# EAGLE design moodlight (EAGLE 6.5.0)
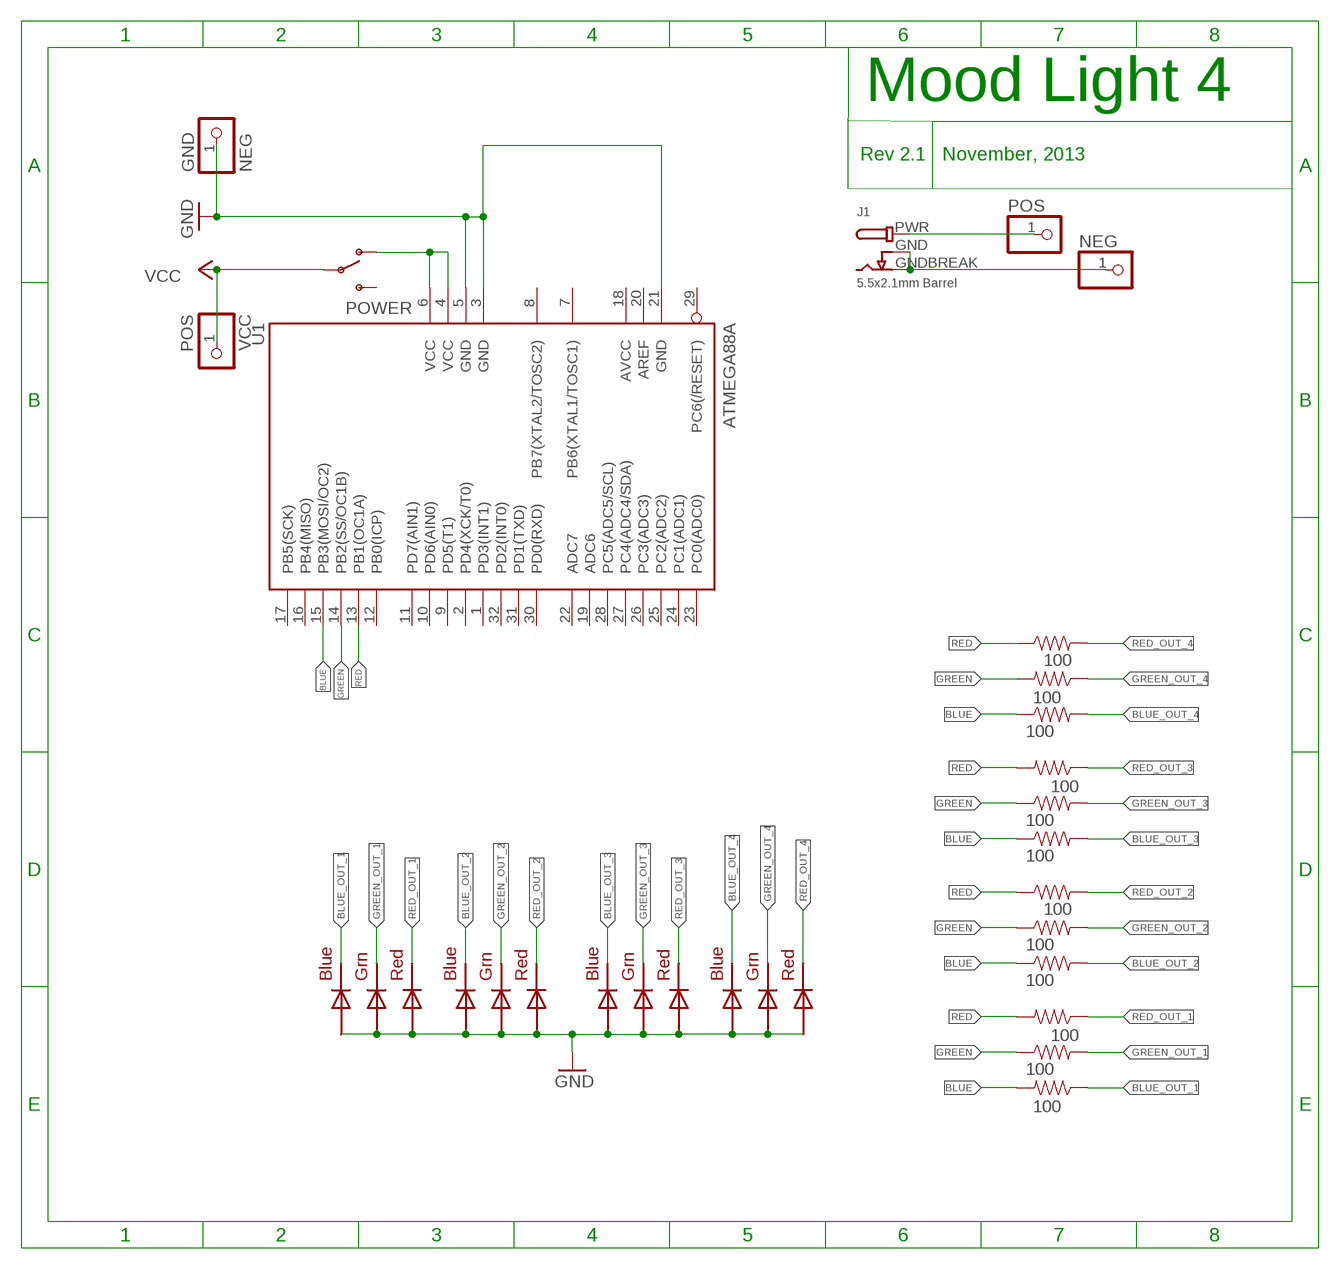
[diagram p0: schematic, sheet 1]

## Parts
GND  NEG  PINHD-1X1  [1X01]
J1  5.5x2.1mm Barrel  DCBARRELSMT  [DCJACK_2MM_SMT]
LED1  RGBLED5050  [RGBLED5050]
LED2  RGBLED5050  [RGBLED5050]
LED3  RGBLED5050  [RGBLED5050]
LED4  RGBLED5050  [RGBLED5050]
NEG  PINHD-1X1  [1X01]
POS  PINHD-1X1  [1X01]
POWER  5V  SWITCH-SPDTPTH  [SWITCH-SPDT]
R1  100  220-5%  [0603-RES]
R2  100  220-5%  [0603-RES]
R3  100  220-5%  [0603-RES]
R4  100  220-5%  [0603-RES]
R5  100  220-5%  [0603-RES]
R6  100  220-5%  [0603-RES]
R7  100  220-5%  [0603-RES]
R8  100  220-5%  [0603-RES]
R9  100  220-5%  [0603-RES]
R10  100  220-5%  [0603-RES]
R11  100  220-5%  [0603-RES]
R12  100  220-5%  [0603-RES]
U1  ATMEGA88A  MEGA8-AI  [TQFP32-08]
VCC  POS  PINHD-1X1  [1X01]

## Nets
BLUE: R3.1 R6.1 R9.1 R12.2 U1.15(PB3(MOSI/OC2))
BLUE_OUT_1: LED1.4(BLUE_C) R12.1
BLUE_OUT_2: LED2.4(BLUE_C) R9.2
BLUE_OUT_3: LED3.4(BLUE_C) R6.2
BLUE_OUT_4: LED4.4(BLUE_C) R3.2
GND: GND.1 LED1.1(GREEN_A) LED1.2(RED_A) LED1.3(BLUE_A) LED2.1(GREEN_A) LED2.2(RED_A) LED2.3(BLUE_A) LED3.1(GREEN_A) LED3.2(RED_A) LED3.3(BLUE_A) LED4.1(GREEN_A) LED4.2(RED_A) LED4.3(BLUE_A) U1.3(GND) U1.5(GND) U1.21(GND)
GREEN: R2.2 R5.1 R8.1 R11.1 U1.14(PB2(SS/OC1B))
GREEN_OUT_1: LED1.6(GREEN_C) R11.2
GREEN_OUT_2: LED2.6(GREEN_C) R8.2
GREEN_OUT_3: LED3.6(GREEN_C) R5.2
GREEN_OUT_4: LED4.6(GREEN_C) R2.1
N$1: POWER.1(O) U1.4(VCC) U1.6(VCC)
N$2: J1.PWR POS.1
N$25: J1.GND(GNDBREAK) J1.GNDBREAK(GND) NEG.1
RED: R1.1 R4.2 R7.1 R10.2 U1.13(PB1(OC1A))
RED_OUT_1: LED1.5(RED_C) R10.1
RED_OUT_2: LED2.5(RED_C) R7.2
RED_OUT_3: LED3.5(RED_C) R4.1
RED_OUT_4: LED4.5(RED_C) R1.2
VCC: POWER.2(P) VCC.1
Unconnected: POWER.3(S) U1.1(PD3(INT1)) U1.2(PD4(XCK/T0)) U1.7(PB6(XTAL1/TOSC1)) U1.8(PB7(XTAL2/TOSC2)) U1.9(PD5(T1)) U1.10(PD6(AIN0)) U1.11(PD7(AIN1)) U1.12(PB0(ICP)) U1.16(PB4(MISO)) U1.17(PB5(SCK)) U1.19(ADC6) U1.20(AREF) U1.22(ADC7) U1.23(PC0(ADC0)) U1.24(PC1(ADC1)) U1.25(PC2(ADC2)) U1.26(PC3(ADC3)) U1.27(PC4(ADC4/SDA)) U1.28(PC5(ADC5/SCL)) U1.29(PC6(/RESET)) U1.30(PD0(RXD)) U1.31(PD1(TXD)) U1.32(PD2(INT0))

## Notes on the sheet
- Mood Light 4
- Rev 2.1   November, 2013

## Power pins joined to a net without a drawn wire
AVCC: U1.18(AVCC)

## Library data of the parts
GND NEG POS VCC = pinhead:PINHD-1X1: PIN HEADER
J1 = microbuilder:DCBARREL: DC Barrel Jack DCJACK_1.3MM_PTH - Through Hole 1.3mm Jack (4UConnector: 05536) DCJACK_2MM_PTH - Through Hole 2.0/2.1 Jack (4UConnector: 05537) DCJACK_2MM_SMT - SMT 2.0/2.1mm Jack(4UConnector: 03267)
LED1-LED4 = adafruit:RGBLED: For 5050 RGB LEDs, the order of the LEDs may vary from one manufacturer to another!
POWER = SparkFun-Electromechanical:SWITCH-SPDT: SPDT Switch Simple slide switch, Spark Fun Electronics SKU : COM-00102 DPDT SMT slide switch, AYZ0202, SWCH-08179
R1-R12 = SparkFun-Resistors:220-5%: 220-ohm SMT 1/8W - 5% (0805) RES-07866; PROD_ID: RES-07866; VALUE: 220
U1 = atmel:MEGA8: MICROCONTROLLER 8 Kbytes FLASH, 1 kbytes SRAM, 512 bytes EEPROM, USART, 6-channel 10 bit ADC, 2-channel 8 bit ADC Pin compatible with Atmega48, ATMega88, ATMega168 Source: avr.lbr; MPN: ATMEGA8-16AU; OC_FARNELL: 9171371; OC_NEWARK: 73M8863

## Net classes
0 default: width 0.305 mm, drill 0.508 mm, clearance 0.254 mm

## Board
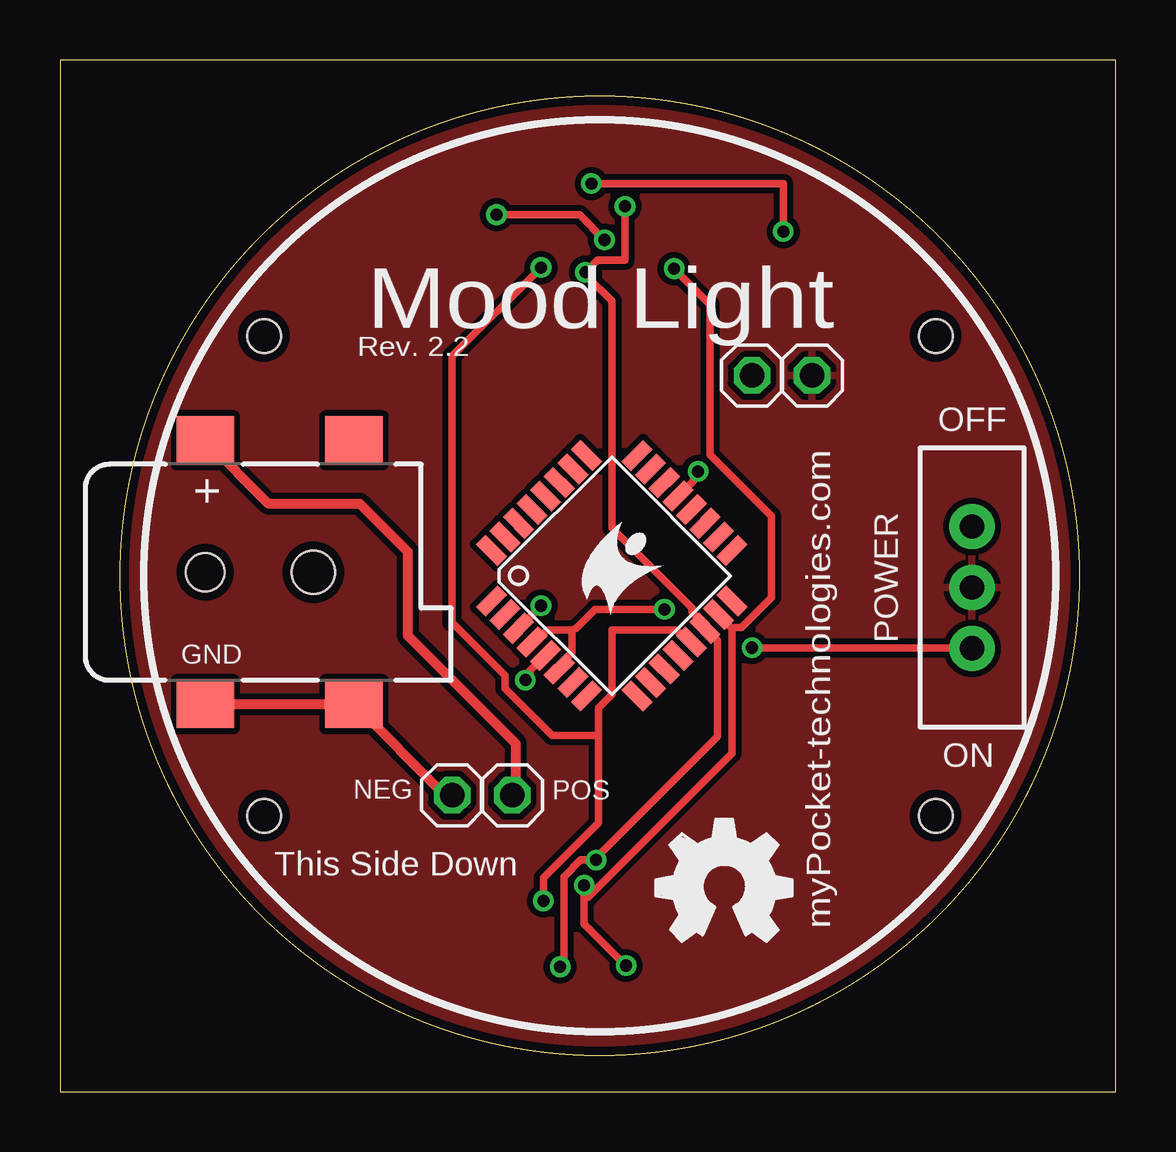
[diagram p1: board, top side]
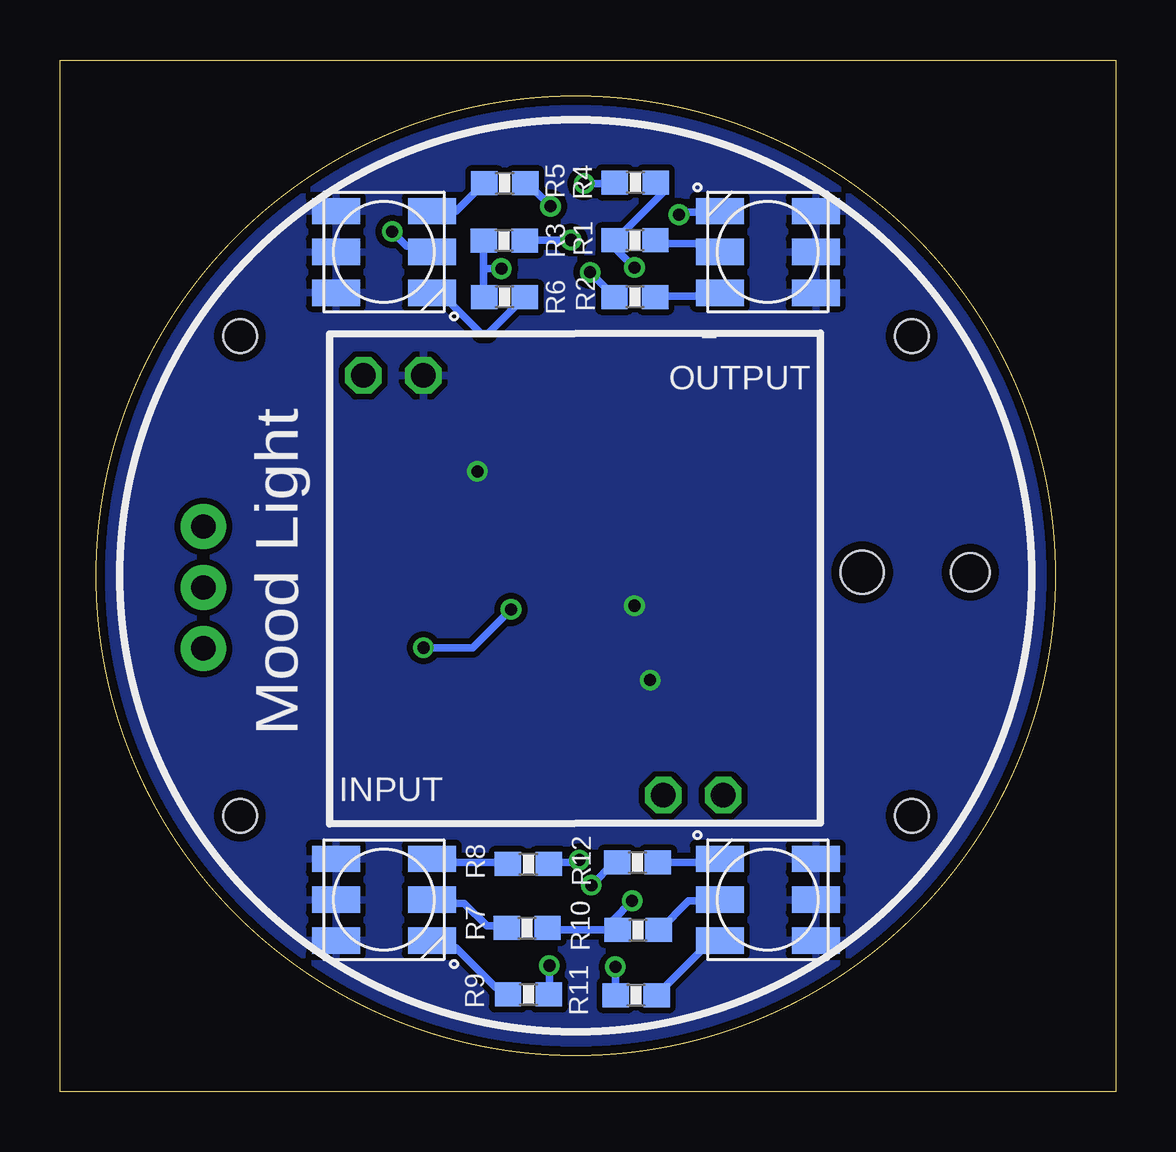
[diagram p2: board, bottom side, seen from below]

Size 44 x 43 mm. Coordinates in mm from the lower left corner, seen from the top.
Outline: 0.5,0 1,0 44,0 44,43 0,43 0,0 0.5,0
Outline: circle at 22.5,21.5 radius 20
Copper layers (1*16): Top 0.0356mm / dielectric 1.5011mm / Bottom 0.0356mm
Design rules "LaenPCBOrder": minimum track width 6mil, minimum drill 13mil, track to track 6mil, track to pad 6mil, pad to pad 6mil, via to via 6mil, smd to smd 6mil, copper to edge 15mil, drill to drill 6mil, minimum pad ring 7mil, minimum via ring 7mil, stop-mask expansion 3mil, vias tented up to drill 0mil, thermal gap 10mil
Holes 1.4 mm at 8.5,31.5 8.5,11.5 36.5,31.5 36.5,11.5

### Footprints (pad centres in the part's own frame; a part is rotated, then mirrored left to right if it is on the bottom)
1X01 = drill 1.016 octagon: 1 0,0
DCJACK_2MM_SMT = smd 2.4 x 2: GND 0,-5.5; GNDBREAK 6.2,-5.5; PWR 0,5.5; PWR2 6.2,5.5 | hole 1.6: 0,0 | hole 1.8: 4.5,0
RGBLED5050 = smd 2 x 1.1: 1 -2,1.7; 2 -2,0; 3 -2,-1.7; 4 2,-1.7; 5 2,0; 6 2,1.7
SWITCH-SPDT = drill 1.016 pad 1.88: 1 0,2.54; 2 0,0; 3 0,-2.54
0603-RES = smd 1.1 x 1: 1 -0.85,0; 2 0.85,0
TQFP32-08 = smd 1.27 x 0.559: 1 -4.293,2.8; 2 -4.293,2; 3 -4.293,1.2; 4 -4.293,0.4; 5 -4.293,-0.4; 6 -4.293,-1.2; 7 -4.293,-2; 8 -4.293,-2.8; 17 4.293,-2.8; 18 4.293,-2; 19 4.293,-1.2; 20 4.293,-0.4; 21 4.293,0.4; 22 4.293,1.2; 23 4.293,2; 24 4.293,2.8 | smd 0.559 x 1.27: 9 -2.8,-4.293; 10 -2,-4.293; 11 -1.2,-4.293; 12 -0.4,-4.293; 13 0.4,-4.293; 14 1.2,-4.293; 15 2,-4.293; 16 2.8,-4.293; 25 2.8,4.293; 26 2,4.293; 27 1.2,4.293; 28 0.4,4.293; 29 -0.4,4.293; 30 -1.2,4.293; 31 -2,4.293; 32 -2.8,4.293

### Placement (x,y rotation side)
GND  28.85,29.85 0 top
J1  6.05,21.65 0 top
LED1  14.5,8 180 bottom
LED2  30.5,8 0 bottom
LED3  30.5,35 0 bottom
LED4  14.5,35 180 bottom
NEG  16.35,12.35 0 top
POS  18.85,12.35 0 top
POWER  38.02,21.01 180 top
R1  20.03,35.48 0 bottom
R2  20.04,33.12 180 bottom
R3  25.48,35.47 0 bottom
R4  20.02,37.89 0 bottom
R5  25.46,37.86 180 bottom
R6  25.47,33.11 0 bottom
R7  24.53,6.81 180 bottom
R8  24.48,9.48 180 bottom
R9  24.47,4.05 180 bottom
R10  19.9,6.74 180 bottom
R11  19.98,4.01 0 bottom
R12  19.93,9.55 180 bottom
U1  23,21.5 45 top
U$1  [OSHW_FILLX200_NOTEXT]  24.85,6.26 0 top
U$2  [MYPOCKETLOGO_SM]  22,21.36 0 top
VCC  31.35,29.85 0 top

### Tracks (layer width: path | path; a pad name or v marks a point on that pad's centre or on a via)
BLUE  (via drill 0.51)
  Top 0.305: v23.6,5.25 21.85,7 21.85,8.1 | v21.85,8.6 21.85,8.1 | 28,19.3 27.45,19.85 U1.15 | 28,19.3 28,14.1 22,8.1 21.85,8.1 | v25.6,34.3 27.1,32.8 27.1,26.55 29.65,24 29.65,20.6 28.4,19.35 28.15,19.35 28,19.3
  Bottom 0.305: 26.35,34.3 26.35,35.45 R3.1 | 26.35,34.3 26.35,33.15 R6.1 | v23.6,5.25 23.6,4.1 R9.1 | v21.85,8.6 20.9,9.55 20.8,9.55 R12.2 | v25.6,34.3 26.35,34.3
BLUE_OUT_1
  Bottom 0.305: LED1.4 16.65,9.55 19.05,9.55 R12.1
BLUE_OUT_2
  Bottom 0.305: LED2.4 28.2,6 27.5,6 25.85,4.35 25.6,4.35 25.35,4.1 R9.2
BLUE_OUT_3
  Bottom 0.305: LED3.4 28.15,33.3 26.45,31.6 26.15,31.6 24.65,33.1 R6.2
BLUE_OUT_4  (via drill 0.51)
  Top 0.305: v22.7,35.5 21.65,36.55 v18.2,36.55
  Bottom 0.305: v22.7,35.5 24.6,35.5 R3.2 | v18.2,36.55 18.1,36.65 16.55,36.65 LED4.4
GND  (via drill 0.51)
  Top 0.305: v19.4,17.15 19.6,17.35 19.6,17.55 20.2,18.15 U1.5 | v20.05,20.25 19.15,19.35 U1.3 | v26.6,25.85 26.4,25.65 26.4,25.45 25.8,24.85 U1.21
  pour Bottom: 0.89,54.04 54.15,54.04 54.15,-0.38 1.29,-0.38 1.29,0.69 0.76,0.69 0.76,54.18
GREEN  (via drill 0.51)
  Top 0.305: v23.55,36.9 23.55,34.65 22.4,34.65 v21.9,34.15 21.95,34 23,32.95 23,23.5 26.35,20.15 26.35,20 26.8,19.55 26.8,19.45 U1.14 26.9,19.3 27.4,18.8 27.4,14.8 22.4,9.8 v22.35,9.65 21.7,9.65 21,8.95 21,5.35 v20.85,5.2
  Bottom 0.305: v21.9,34.15 20.9,33.15 R2.2 | v23.55,36.9 24.5,37.85 R5.1 | v20.85,5.2 20.85,4.05 R11.1 | v22.35,9.65 22.45,9.55 23.55,9.55 23.6,9.5 R8.1
GREEN_OUT_1
  Bottom 0.305: LED1.6 16.85,6.3 19.1,4.05 R11.2
GREEN_OUT_2
  Bottom 0.305: LED2.6 28.35,9.55 25.4,9.55 25.35,9.5 R8.2
GREEN_OUT_3
  Bottom 0.305: LED3.6 27.5,36.7 26.35,37.85 R5.2
GREEN_OUT_4
  Bottom 0.305: LED4.6 16.65,33.15 19.15,33.15 R2.1
N$1  (via drill 0.51)
  Top 0.305: 21.35,19.25 20.3,19.25 19.8,18.75 19.7,18.75 U1.4 | 21.35,19.25 21.35,18.3 20.85,17.8 20.85,17.65 U1.6 | v25.2,20.1 22.3,20.1 21.5,19.3 21.35,19.25 | v28.85,18.5 38,18.5 POWER.1
  Bottom 0.305: v25.2,20.1 26.8,18.5 v28.85,18.5
N$2
  Top 0.305: 6.85,26.35 6.1,27.1 J1.PWR
  Top 0.406: POS.1 19,12.35 19,14.5 14.5,19 14.5,22.5 12.5,24.5 8.7,24.5 J1.PWR
N$25
  Top 0.305: 6.1,16.15 J1.GND | J1.GNDBREAK 12.4,16.1 12.6,16.1
  Top 0.406: NEG.1 16.05,12.35 J1.GNDBREAK 6.1,16.15
RED  (via drill 0.51)
  Top 0.305: 22.45,14.85 22.45,11.2 20.15,8.9 v20.15,7.95 | 22.45,14.85 22.45,16 23,16.55 23,19.25 25.7,19.25 26.2,18.75 26.3,18.75 U1.13 | v20.05,34.35 16.35,30.65 16.35,19.55 18.55,17.35 18.55,16.8 20.5,14.85 22.45,14.85
  Bottom 0.305: R4.2 19.15,37.85 18.85,37.85 18.85,37.5 20.85,35.5 R1.1 20.8,35.35 20.8,35.1 v20.05,34.35 | R7.1 23.65,6.8 23.6,6.75 R10.2 21,6.9 21,7.1 v20.15,7.95
RED_OUT_1
  Bottom 0.305: LED1.5 16.55,7.95 17.8,7.95 19,6.75 R10.1
RED_OUT_2
  Bottom 0.305: LED2.5 28.35,7.85 27.15,7.85 26.2,6.9 25.45,6.9 25.4,6.85 R7.2
RED_OUT_3  (via drill 0.51)
  Top 0.305: v22.15,37.85 30.15,37.85 v30.15,35.85
  Bottom 0.305: v22.15,37.85 20.9,37.85 R4.1 | v30.15,35.85 29.55,35.25 28.75,35.25 LED3.5
RED_OUT_4
  Bottom 0.305: LED4.5 16.85,35.35 19.05,35.35 19.15,35.45 R1.2
VCC
  pour Top: -0.92,55.7 56.26,55.44 55.23,-0.94 -0.67,-1.12

### Text on the board
tNames: Mood Light | Rev. 2.2 | OFF | myPocket-technologies.com | ON | This Side Down
bNames: - | OUTPUT | Mood Light | INPUT